# EAGLE schematic common_board_smd (EAGLE 6.5.0)
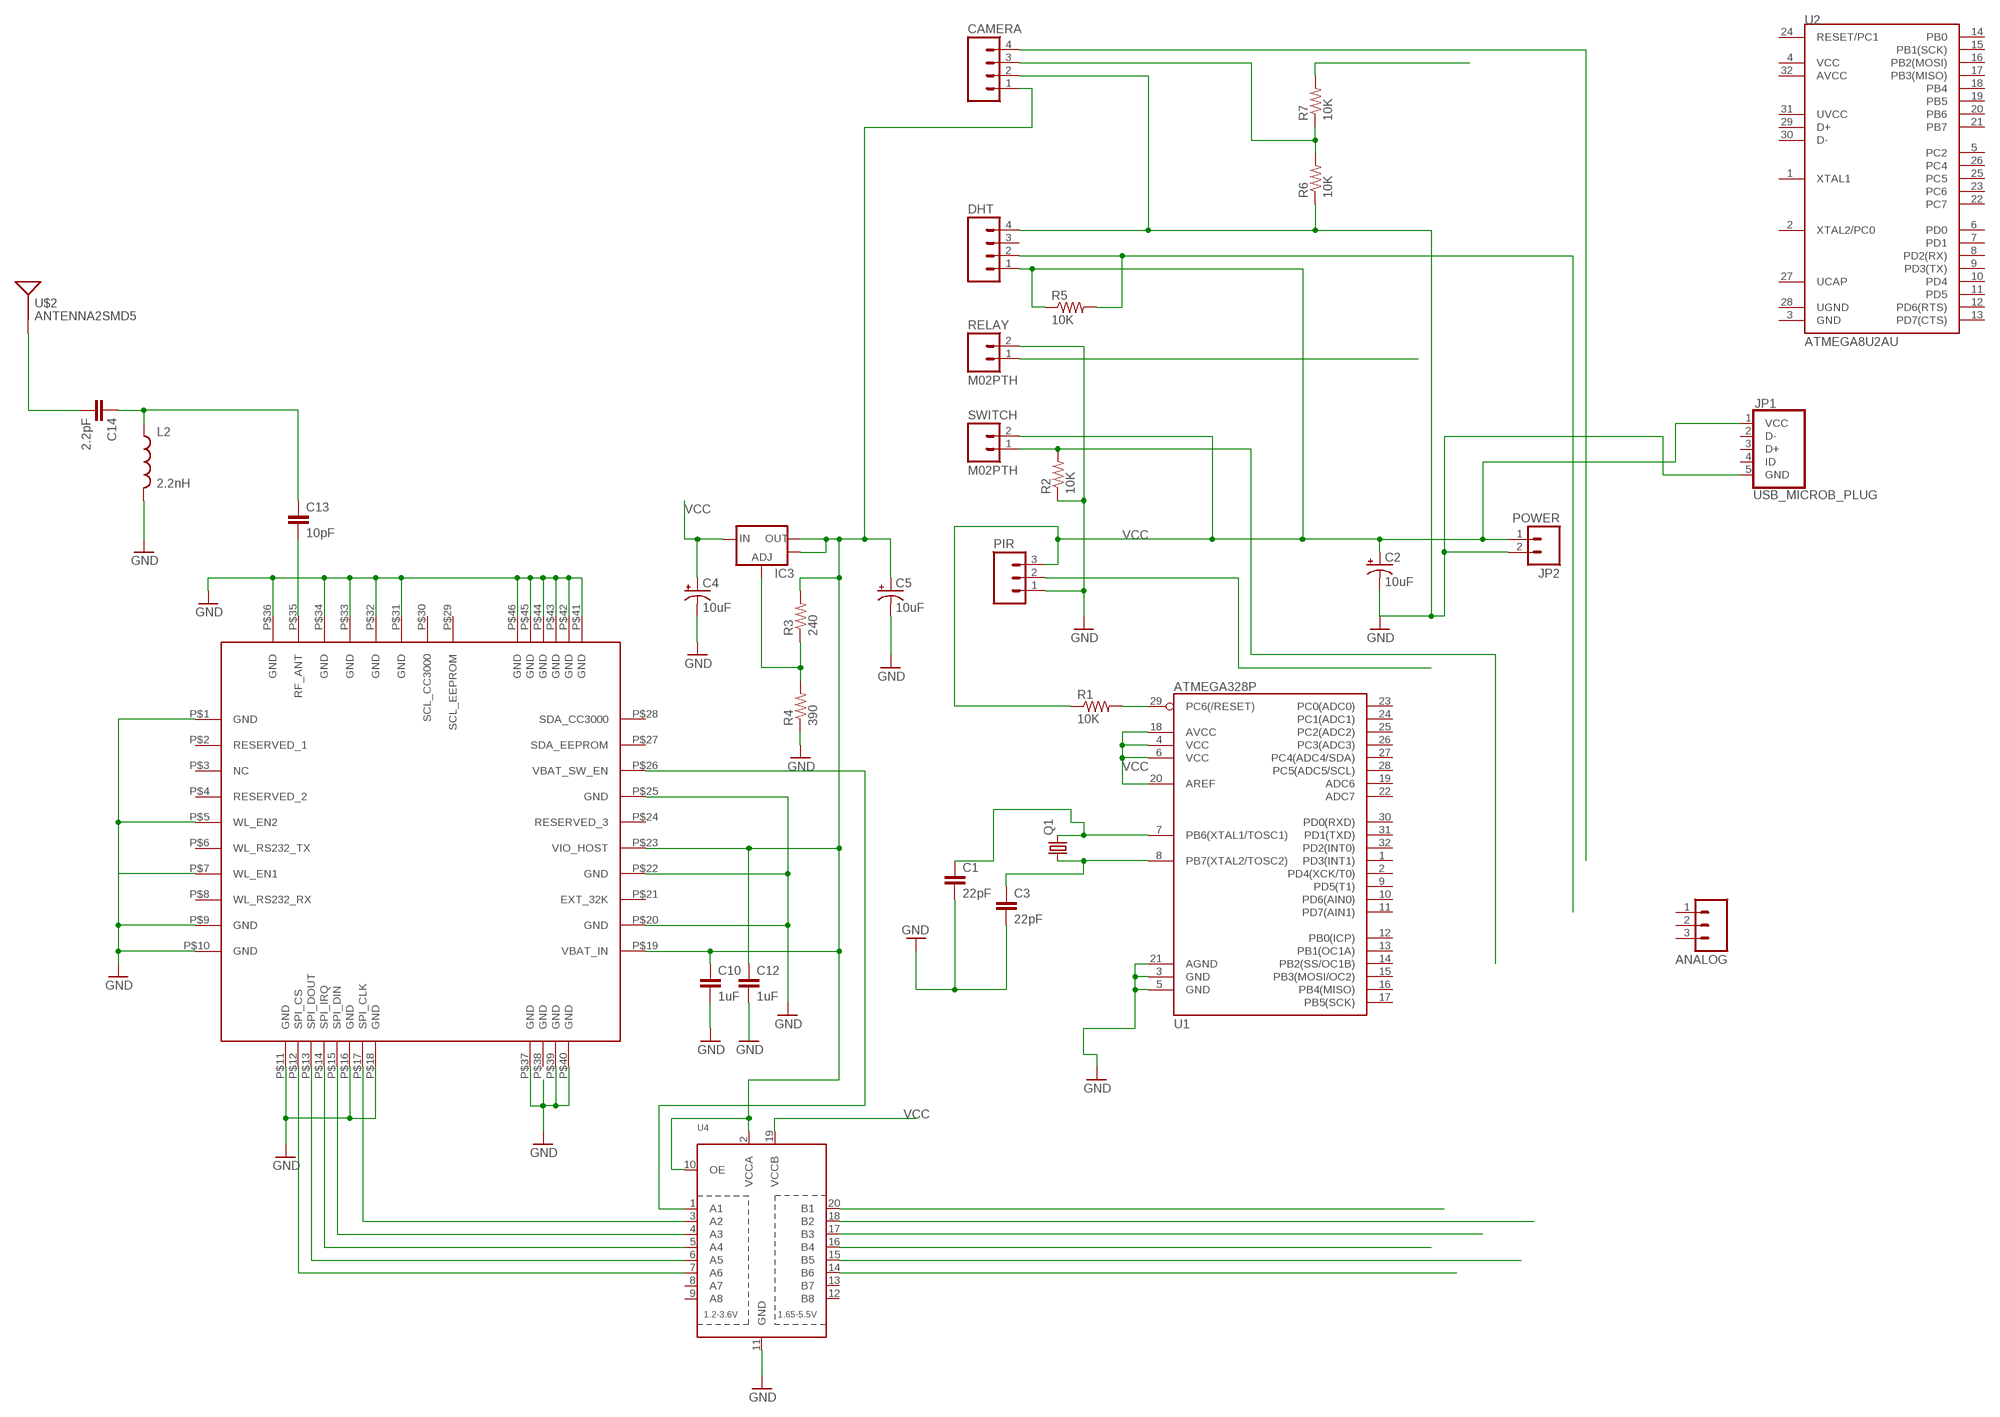
[diagram p0: schematic, sheet 1]

## Parts
ANALOG  M03PTH  [1X03]
C1  22pF  CAP0805  [0805]
C2  10uF  CAP_POL1206  [EIA3216]
C3  22pF  CAP0805  [0805]
C4  10uF  CAP_POL3528  [EIA3528]
C5  10uF  CAP_POL3528  [EIA3528]
C10  1uF  CAP1206  [1206]
C12  1uF  CAP1206  [1206]
C13  10pF  CAP0805  [0805]
C14  2.2pF  CAP0805  [0805]
CAMERA  M04PTH  [1X04]
DHT  M04PTH  [1X04]
IC3  V_REG_LM1117SOT223  [SOT223]
JP1  USB_MICROB_PLUG  [MICRO-B-RA-SMT]
JP2  POWER  M02PTH  [1X02]
L2  2.2nH  INDUCTOR0805  [0805]
PIR  M03PTH  [1X03]
Q1  CRYSTALHC49U-V  [HC49U-V]
R1  10K  RESISTOR0805-RES  [0805]
R2  10K  RESISTOR0805-RES  [0805]
R3  240  RESISTOR0805-RES  [0805]
R4  390  RESISTOR0805-RES  [0805]
R5  10K  RESISTOR0805-RES  [0805]
R6  10K  RESISTOR0805-RES  [0805]
R7  10K  RESISTOR0805-RES  [0805]
RELAY  M02PTH  [1X02]
SWITCH  M02PTH  [1X02]
U1  ATMEGA328P  ATMEGA328_SMT  [TQFP32-08]
U2  ATMEGA8U2AU  [TQFP32-08]
U4  TXB0108PWR  [TSSOP20]
U$1  CC3000  [CC3000]
U$2  ANTENNA2SMD5  [ANTENNA-CHIP5]

## Nets
GND [gnd]: C1.2 C2.C(-) C3.2 C4.C(-) C5.C(-) C10.2 CAMERA.2 DHT.4 JP1.5(GND) JP2.2 L2.2 PIR.1 R2.1 R4.1 R6.1 RELAY.2 U1.3(GND) U1.5(GND) U1.21(AGND) U4.11(GND) U$1.P$1(GND) U$1.P$5(WL_EN2) U$1.P$7(WL_EN1) U$1.P$9(GND) U$1.P$10(GND) U$1.P$11(GND) U$1.P$16(GND) U$1.P$18(GND) U$1.P$20(GND) U$1.P$22(GND) U$1.P$25(GND) U$1.P$31(GND) U$1.P$32(GND) U$1.P$33(GND) U$1.P$34(GND) U$1.P$36(GND) U$1.P$37(GND) U$1.P$39(GND) U$1.P$40(GND) U$1.P$41(GND) U$1.P$42(GND) U$1.P$43(GND) U$1.P$44(GND) U$1.P$45(GND) U$1.P$46(GND)
N$1: U4.20(B1)
N$2: U4.16(B4)
N$3: R1.2 U1.29(PC6(/RESET))
N$4: C3.1 Q1.1 U1.8(PB7(XTAL2/TOSC2))
N$5: U4.18(B2)
N$6: U4.14(B6)
N$7: C12.2
N$8: C5.A(+) C10.1 C12.1 CAMERA.1 IC3.2(OUT) IC3.4(OUT) R3.2 U4.2(VCCA) U4.10(OE) U$1.P$19(VBAT_IN) U$1.P$23(VIO_HOST)
N$9: U4.7(A6) U$1.P$12(SPI_CS)
N$10: U4.6(A5) U$1.P$13(SPI_DOUT)
N$11: U4.5(A4) U$1.P$14(SPI_IRQ)
N$12: U4.4(A3) U$1.P$15(SPI_DIN)
N$13: U4.3(A2) U$1.P$17(SPI_CLK)
N$14: U4.1(A1) U$1.P$26(VBAT_SW_EN)
N$15: IC3.1(ADJ) R3.1 R4.2
N$16: C13.2 U$1.P$35(RF_ANT)
N$17: C13.1 C14.1 L2.1
N$18: C14.2 U$2.FEED(SIGNAL)
N$19: U4.15(B5)
N$20: U4.17(B3)
N$21: R2.2 SWITCH.1
N$22: DHT.2 R5.2
N$23: RELAY.1
N$24: CAMERA.3 R6.2 R7.1
N$25: R7.2
N$26: PIR.2
N$27: CAMERA.4
VCC [usbvcc]: C2.A(+) C4.A(+) DHT.1 IC3.3(IN) JP1.1(VCC) JP2.1 PIR.3 R1.1 R5.1 SWITCH.2 U1.4(VCC) U1.6(VCC) U1.18(AVCC) U1.20(AREF) U4.19(VCCB)
XTAL2: C1.1 Q1.2 U1.7(PB6(XTAL1/TOSC1))
Unconnected: ANALOG.1 ANALOG.2 ANALOG.3 DHT.3 JP1.2(D-) JP1.3(D+) JP1.4(ID) U1.1(PD3(INT1)) U1.2(PD4(XCK/T0)) U1.9(PD5(T1)) U1.10(PD6(AIN0)) U1.11(PD7(AIN1)) U1.12(PB0(ICP)) U1.13(PB1(OC1A)) U1.14(PB2(SS/OC1B)) U1.15(PB3(MOSI/OC2)) U1.16(PB4(MISO)) U1.17(PB5(SCK)) U1.19(ADC6) U1.22(ADC7) U1.23(PC0(ADC0)) U1.24(PC1(ADC1)) U1.25(PC2(ADC2)) U1.26(PC3(ADC3)) U1.27(PC4(ADC4/SDA)) U1.28(PC5(ADC5/SCL)) U1.30(PD0(RXD)) U1.31(PD1(TXD)) U1.32(PD2(INT0)) U2.1(XTAL1) U2.2(XTAL2/PC0) U2.3(GND) U2.4(VCC) U2.5(PC2) U2.6(PD0) U2.7(PD1) U2.8(PD2(RX)) U2.9(PD3(TX)) U2.10(PD4) U2.11(PD5) U2.12(PD6(RTS)) U2.13(PD7(CTS)) U2.14(PB0) U2.15(PB1(SCK)) U2.16(PB2(MOSI)) U2.17(PB3(MISO)) U2.18(PB4) U2.19(PB5) U2.20(PB6) U2.21(PB7) U2.22(PC7) U2.23(PC6) U2.24(RESET/PC1) U2.25(PC5) U2.26(PC4) U2.27(UCAP) U2.28(UGND) U2.29(D+) U2.30(D-) U2.31(UVCC) U2.32(AVCC) U4.8(A7) U4.9(A8) U4.12(B8) U4.13(B7) U$1.P$2(RESERVED_1) U$1.P$3(NC) U$1.P$4(RESERVED_2) U$1.P$6(WL_RS232_TX) U$1.P$8(WL_RS232_RX) U$1.P$21(EXT_32K) U$1.P$24(RESERVED_3) U$1.P$27(SDA_EEPROM) U$1.P$28(SDA_CC3000) U$1.P$38(GND)

## Power pins joined to a net without a drawn wire
SCL_CC3000: U$1.P$30(SCL_CC3000)
SCL_EEPROM: U$1.P$29(SCL_EEPROM)

## Library data of the parts
ANALOG PIR = SparkFun-Connectors:M03: Header 3 Standard 3-pin 0.1" header. Use with straight break away headers (SKU : PRT-00116), right angle break away headers (PRT-00553), swiss pins (PRT-00743), machine pins (PRT-00117), and female headers (PRT-00115). Molex polarized connector foot print use with SKU : PRT-08232 with associated crimp pins and housings.
C1 C3 = SparkFun-Passives:CAP: Capacitor Standard 0603 ceramic capacitor, and 0.1" leaded capacitor.
C2 C4 C5 = SparkFun-Passives:CAP_POL: Capacitor Polarized These are standard SMD and PTH capacitors. Normally 10uF, 47uF, and 100uF in electrolytic and tantalum varieties. Always verify the external diameter of the through hole cap, it varies with capacity, voltage, and manufacturer. The EIA devices should be standard.
C10 C12-C14 = SparkFun-Capacitors:CAP: Capacitor Standard 0603 ceramic capacitor, and 0.1" leaded capacitor.
CAMERA DHT = SparkFun-Connectors:M04: Header 4 Standard 4-pin 0.1" header. Use with straight break away headers (SKU : PRT-00116), right angle break away headers (PRT-00553), swiss pins (PRT-00743), machine pins (PRT-00117), and female headers (PRT-00115). Molex polarized connector foot print use with SKU : PRT-08231 with associated crimp pins and housings. 1MM SMD Version SKU: PRT-10208
IC3 = SparkFun-PowerIC:V_REG_LM1117: Voltage Regulator LM1117 Standard adjustable voltage regulator but in SMD form. Spark Fun Electronics SKU : COM-00595
JP1 = SparkFun-Connectors:USB_MICROB_PLUG: USB Micro-B Plug Comes in a variety of packages. Check out Hirose's ZX-x0 line: http://www.hirose.co.jp/cataloge_hp/e24200011.pdf
JP2 RELAY SWITCH = SparkFun-Connectors:M02: Standard 2-pin 0.1" header. Use with - straight break away headers ( PRT-00116) - right angle break away headers (PRT-00553) - swiss pins (PRT-00743) - machine pins (PRT-00117) - female headers (PRT-00115) Molex polarized connector foot print use with: PRT-08233 with associated crimp pins and housings. 2.54_SCREWTERM for use with PRT-10571. 3.5mm Screw Terminal footprints for PRT-08084 5mm Screw Terminal footprints for use with PRT-08433
L2 = SparkFun-Passives:INDUCTOR: Inductors Basic Inductor/Choke - 0603 and 1206. Footprints are not proven and vary greatly between part numbers. SRN6045- 33uH, 20% 1.4A
Q1 = adafruit:CRYSTAL: CRYSTAL; OC_FARNELL: 1666969; OC_NEWARK: unknown
R1 R2 R5-R7 = SparkFun-Passives:RESISTOR: Resistor Basic schematic elements and footprints for 0603, 1206, and PTH resistors.
R3 R4 = SparkFun-Resistors:RESISTOR: Resistor Basic schematic elements and footprints for 0603, 1206, and PTH resistors.
U1 = SparkFun-DigitalIC:ATMEGA328_SMT: 32-Pin Atmega328 part Commonly used on Arduino compatible boards Available in QFP and QFN packages TQFP is IC-09069 QFN is non-stock; PROD_ID: IC-09069
U2 = SparkFun-DigitalIC:ATMEGA8U2: Atmel 32-pin 8-bit Microcontroller with 8/16/32K Bystes of ISP Flash and USB Controller. ATmega8U2, ATmega16U2, and ATmega32U2
U4 = adafruit:TXB0108PWR: 8-Bit Bi-Directional Level Shifter 1.2V-3.6V (VCCA) to 1.65V-5.5V (VCCB) bi-directional level shifter with auto direction sensing. Max data rate - VCCA 1.8V: 20Mbps (50ns), VCCA 3.3V: 100Mbps (10ns) Digikey: 296-21527-1-ND
U$1 = centerblack_engineering:CC3000: TI SimpleLink CC3000 Module - WiFi 802.11b/g Network Processor; AUTHOR: Matt Bigarani; DATASHEET: http://www.ti.com/lit/ds/symlink/cc3000.pdf; DATE: 2/8/2013
U$2 = SparkFun-RF-Modified:ANTENNA2: Chip antenna Single endded antenna. Common with smaller chip antennas. CHIP4 package is the GPS Chip Antenna SKU: GPS-08418. CHIP5 package is 2.4GHz chip antenna SKU: WRL-00144.

## Net classes
0 default: width 0.152 mm, clearance 0.152 mm
1 power: width 0.61 mm, drill 0.61 mm, clearance 0.254 mm
2 gnd: width 0.203 mm, drill 0.559 mm, clearance 0.152 mm
3 usbvcc: width 0.203 mm, drill 0.61 mm, clearance 0.152 mm
4 aref: width 0.406 mm, drill 0.61 mm, clearance 0.254 mm